# EAGLE design untitled (EAGLE 6.2)
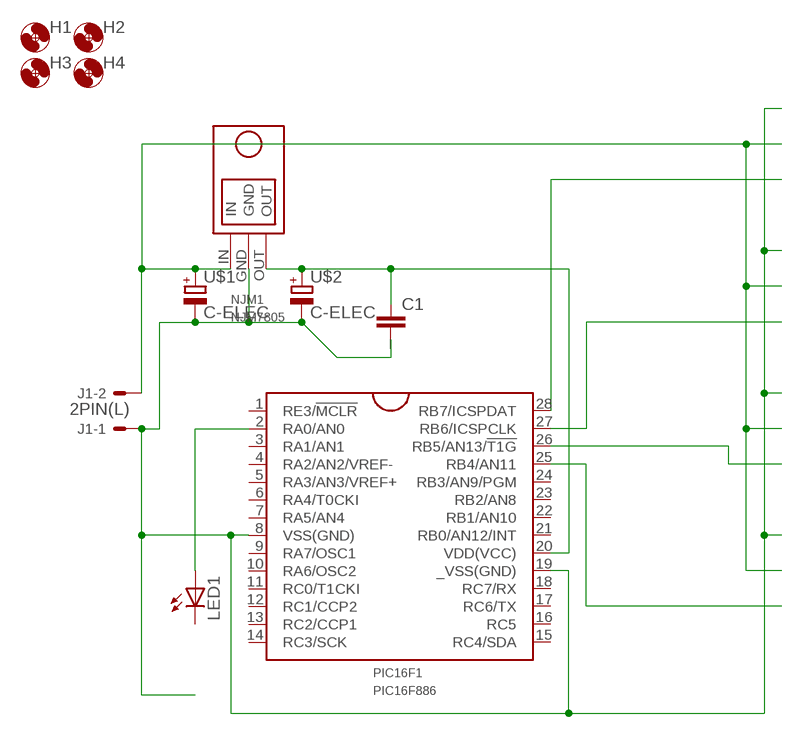
[diagram p0: schematic, sheet 1]

## Parts
C1  C-  [C-2.54]
H1  HOLE3.3M3BOLT  [HOLE3.3]
H2  HOLE3.3M3BOLT  [HOLE3.3]
H3  HOLE3.3M3BOLT  [HOLE3.3]
H4  HOLE3.3M3BOLT  [HOLE3.3]
J1  2PIN(L)  [2PL]
LED1  LED  [LED5MM]
NJM1  NJM7805  [NJM7805]
PIC16F1  PIC16F886  [DIL28-3]
U$1  C-ELEC  [C-6MM]
U$2  C-ELEC  [C-6MM]

## Nets
N$1: J1.1 NJM1.GND PIC16F1.8(VSS(GND)) PIC16F1.19(_VSS(GND)) U$1.- U$2.-
N$2: J1.2 NJM1.IN U$1.+
N$3: NJM1.OUT PIC16F1.20(VDD(VCC)) U$2.+
N$4: PIC16F1.28(RB7/ICSPDAT)
N$6: PIC16F1.27(RB6/ICSPCLK)
N$7: PIC16F1.26(RB5/AN13/!T1G)
N$8: PIC16F1.25(RB4/AN11)
N$9: LED1.A PIC16F1.2(RA0/AN0)
Unconnected: C1.P$1 C1.P$2 LED1.K(C) PIC16F1.1(RE3/!MCLR) PIC16F1.3(RA1/AN1) PIC16F1.4(RA2/AN2/VREF-) PIC16F1.5(RA3/AN3/VREF+) PIC16F1.6(RA4/T0CKI) PIC16F1.7(RA5/AN4) PIC16F1.9(RA7/OSC1) PIC16F1.10(RA6/OSC2) PIC16F1.11(RC0/T1CKI) PIC16F1.12(RC1/CCP2) PIC16F1.13(RC2/CCP1) PIC16F1.14(RC3/SCK) PIC16F1.15(RC4/SDA) PIC16F1.16(RC5) PIC16F1.17(RC6/TX) PIC16F1.18(RC7/RX) PIC16F1.21(RB0/AN12/INT) PIC16F1.22(RB1/AN10) PIC16F1.23(RB2/AN8) PIC16F1.24(RB3/AN9/PGM)

## Library data of the parts
C1 = My_rcl:C-
H1-H4 = FP-21T for MITS:HOLE3.3
J1 = my_connector:2PIN(L)
LED1 = led:LED: LED
NJM1 = My_NJM7805:NJM7805
PIC16F1 = FixLib:PIC16F886
U$1 U$2 = My_rcl:C-ELEC

## Board
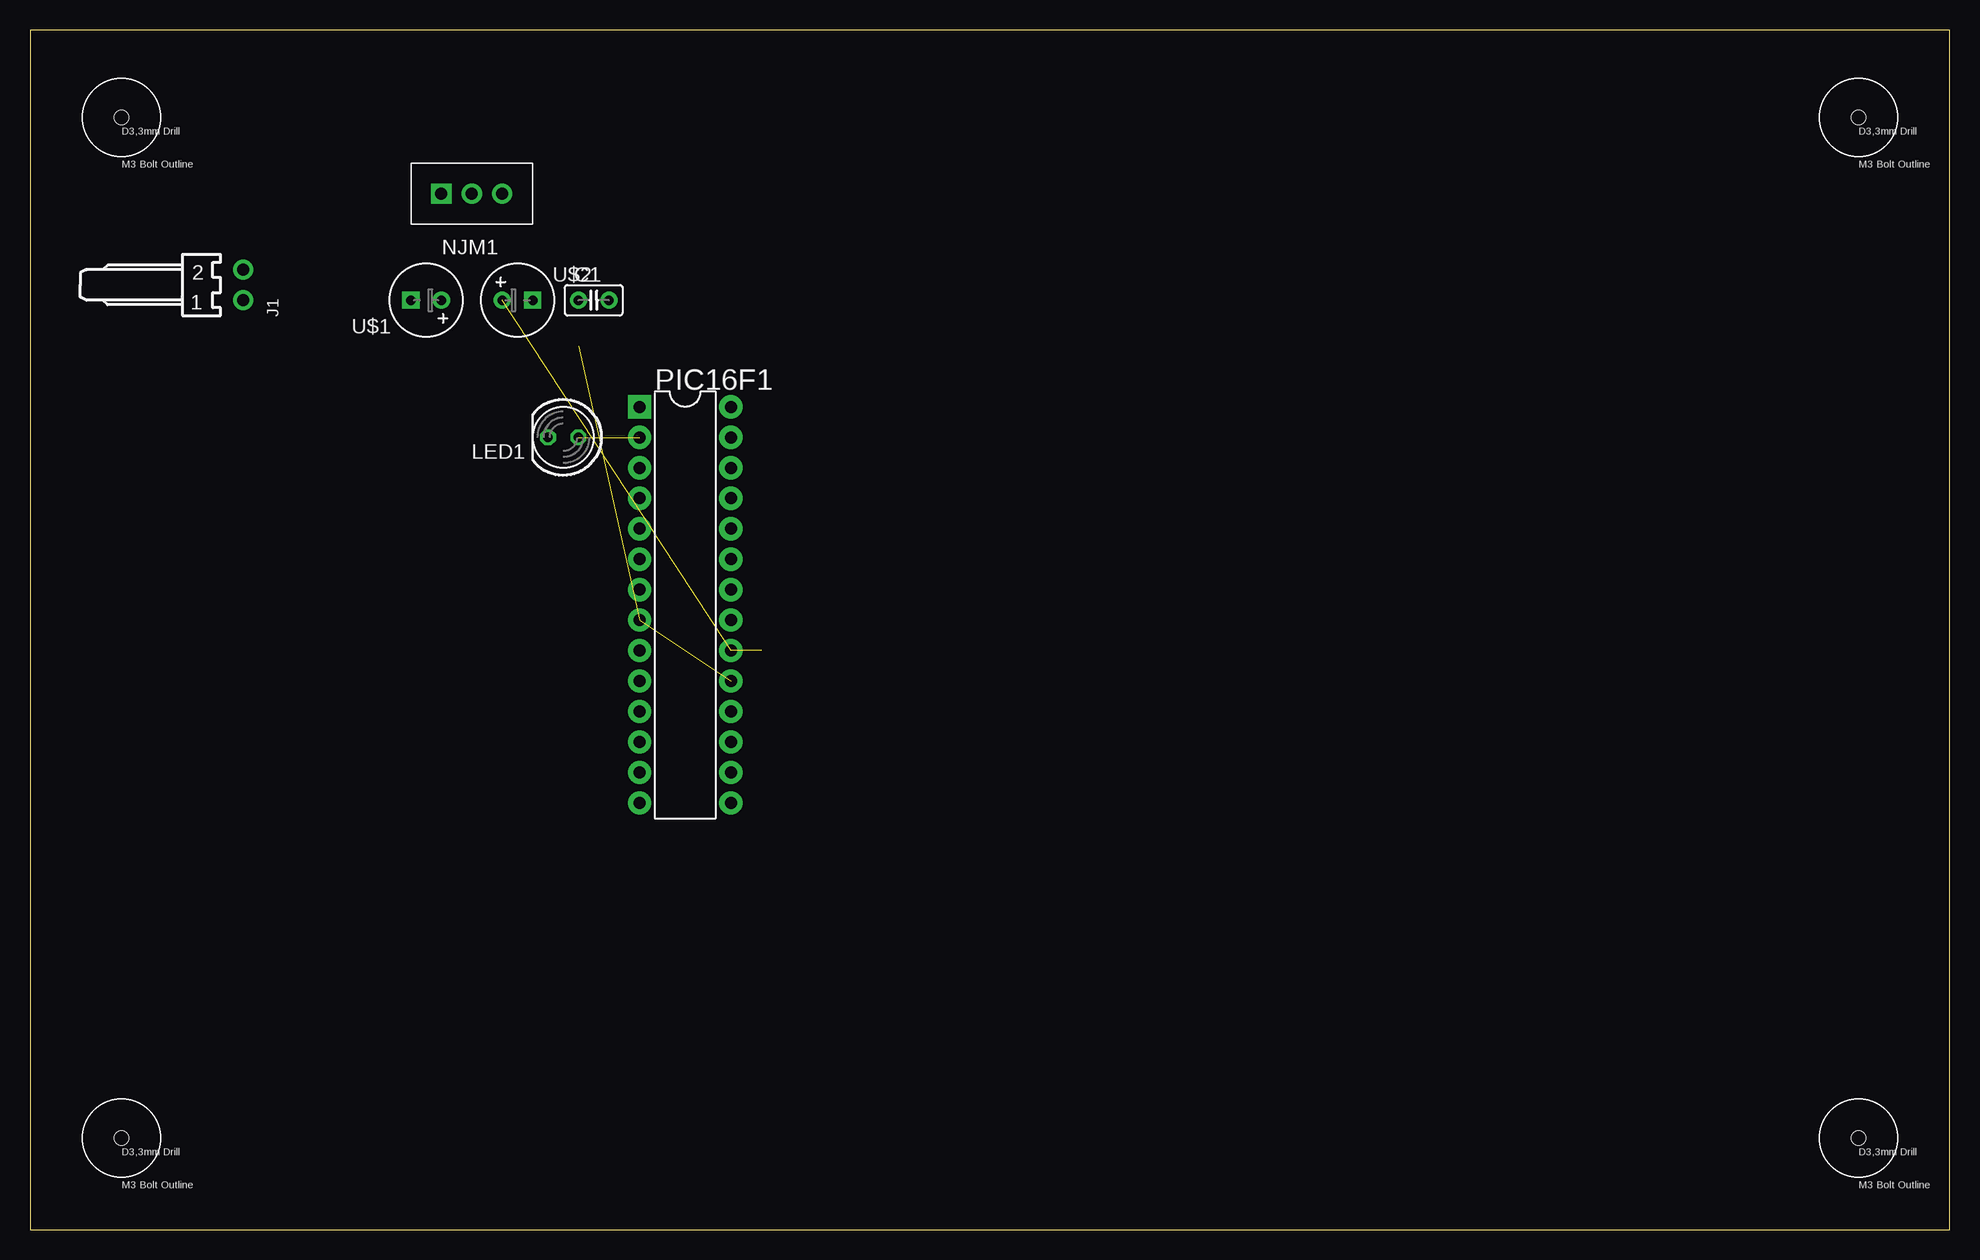
[diagram p1: board, top side]
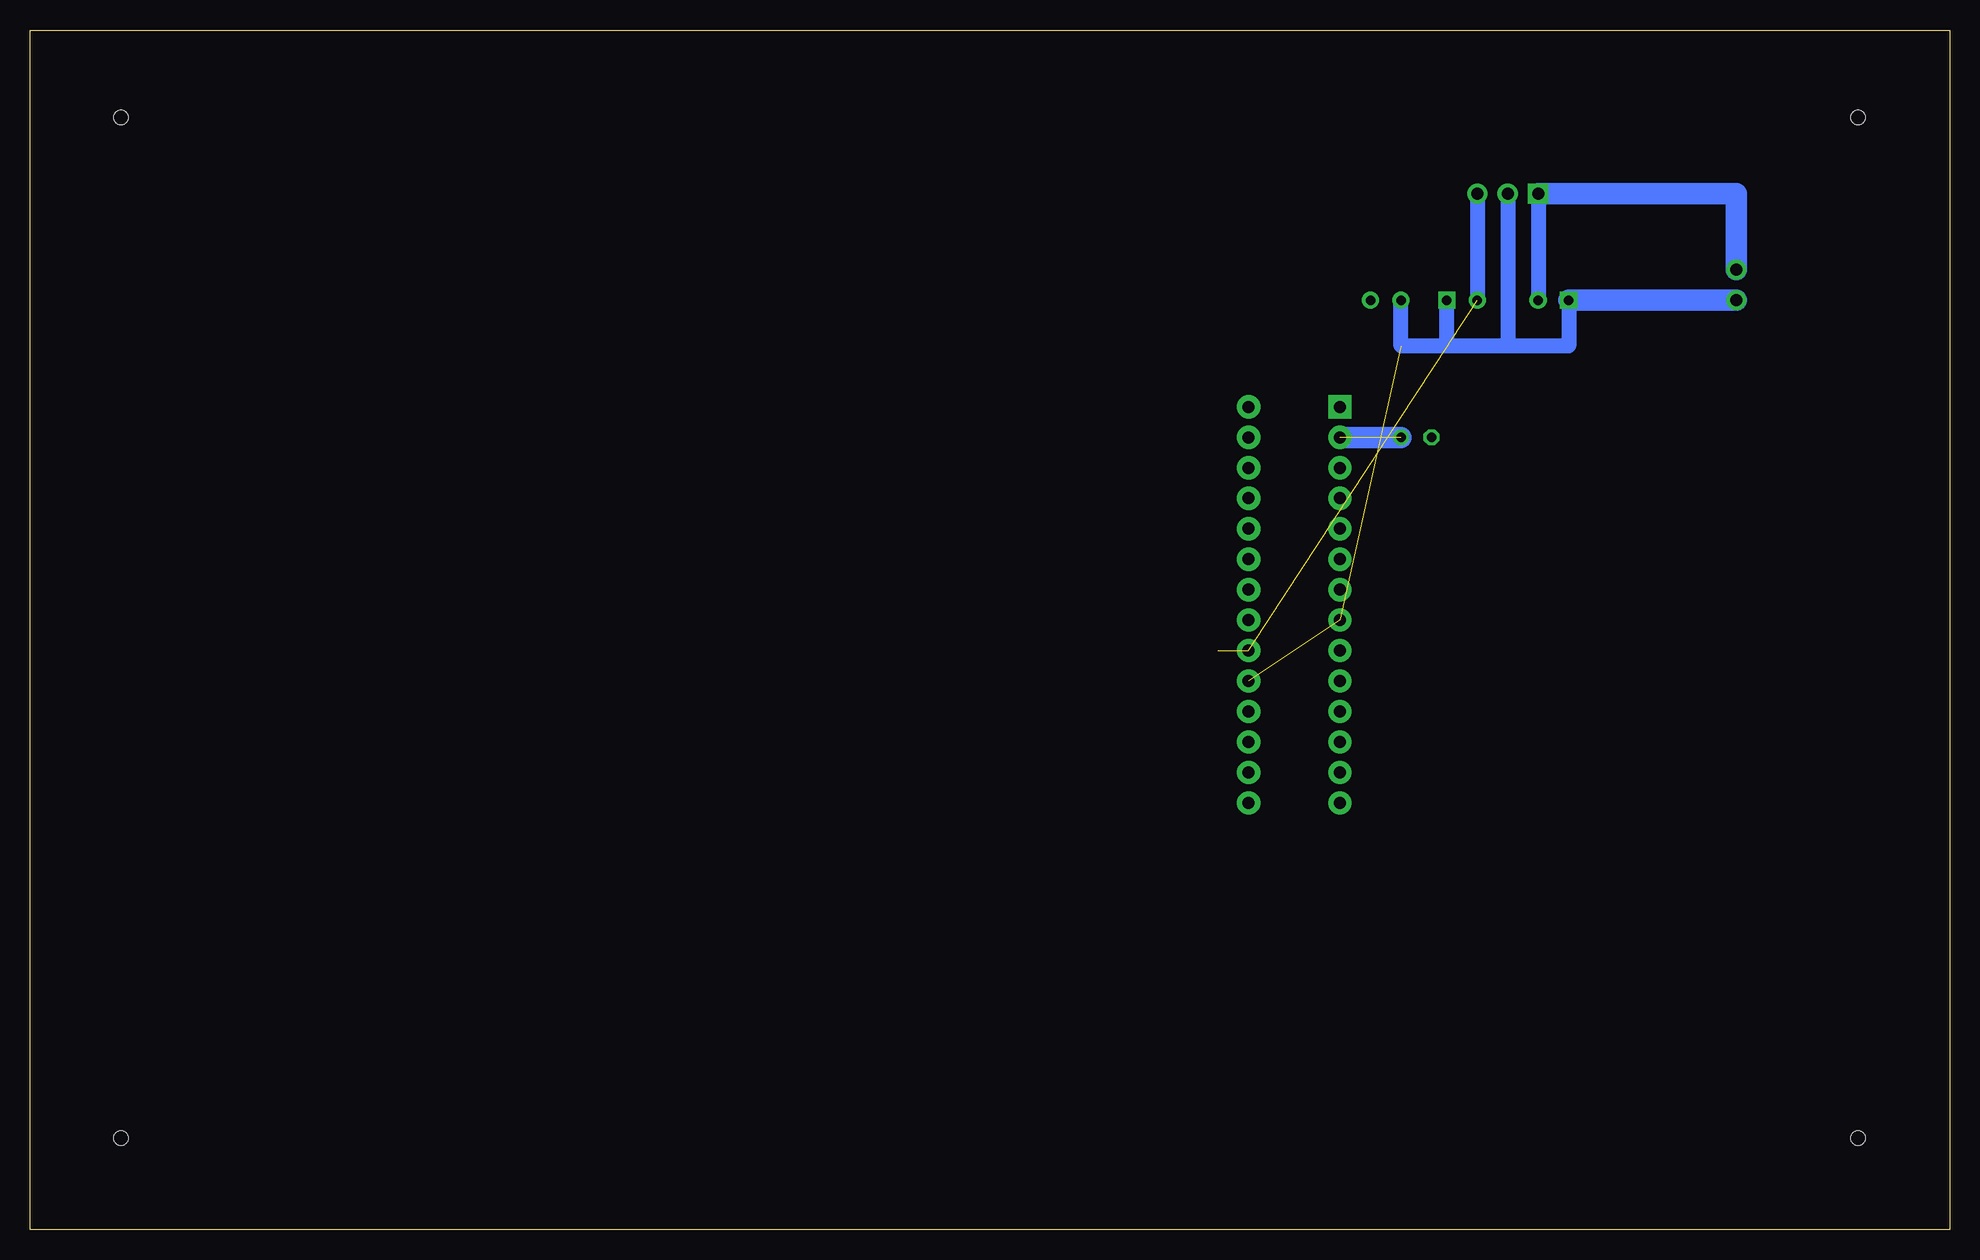
[diagram p2: board, bottom side, seen from below]

Size 160 x 100 mm. Coordinates in mm from the lower left corner, seen from the top.
Outline: 0,0 160,0 160,100 0,100 0,0
Copper layers (1*16): Top 0.035mm / dielectric 1.5mm / Bottom 0.035mm
Design rules: minimum track width 10mil, minimum drill 24mil, track to track 8mil, track to pad 8mil, pad to pad 8mil, via to via 8mil, smd to smd 8mil, copper to edge 40mil, drill to drill 8mil, minimum pad ring 10mil, minimum via ring 8mil, stop-mask expansion 4mil, vias tented up to drill 0mil, thermal gap 10mil

### Footprints (pad centres in the part's own frame; a part is rotated, then mirrored left to right if it is on the bottom)
C-2.54 = drill 0.8 pad 1.422: P$1 -1.27,0; P$2 1.27,0
HOLE3.3 = hole 1.2: 0,0
2PL = drill 1 pad 1.676: 1 1.27,3.81; 2 -1.27,3.81
LED5MM = drill 0.8 octagon: A -1.27,0; K 1.27,0
NJM7805 = drill 1 pad 1.676: GND 0,0; OUT 2.54,0 | drill 1 pad 1.676 square: IN -2.54,0
DIL28-3 = drill 1 pad 1.93 square: 1 -16.51,-3.81 | drill 1 pad 1.93: 2 -13.97,-3.81; 3 -11.43,-3.81; 4 -8.89,-3.81; 5 -6.35,-3.81; 6 -3.81,-3.81; 7 -1.27,-3.81; 8 1.27,-3.81; 9 3.81,-3.81; 10 6.35,-3.81; 11 8.89,-3.81; 12 11.43,-3.81; 13 13.97,-3.81; 14 16.51,-3.81; 15 16.51,3.81; 16 13.97,3.81; 17 11.43,3.81; 18 8.89,3.81; 19 6.35,3.81; 20 3.81,3.81; 21 1.27,3.81; 22 -1.27,3.81; 23 -3.81,3.81; 24 -6.35,3.81; 25 -8.89,3.81; 26 -11.43,3.81; 27 -13.97,3.81; 28 -16.51,3.81
C-6MM = drill 0.8 pad 1.422: + -1.27,0 | drill 0.8 pad 1.422 square: - 1.27,0

### Placement (x,y rotation side)
C1  46.99,77.47 0 top
H1  7.62,92.71 0 top
H2  7.62,7.62 0 top
H3  152.4,7.62 0 top
H4  152.4,92.71 0 top
J1  13.97,78.74 270 top
LED1  44.45,66.04 180 top
NJM1  36.83,86.36 0 top
PIC16F1  54.61,52.07 270 top
U$1  33.02,77.47 180 top
U$2  40.64,77.47 0 top

### Tracks (layer width: path | path; a pad name or v marks a point on that pad's centre or on a via)
N$1  (2 unrouted)
  Bottom 1.27: NJM1.GND 36.83,73.66 | 36.83,73.66 41.91,73.66 | 41.91,73.66 U$2.- | U$1.- 31.75,73.66 36.83,73.66 | 41.91,73.66 45.72,73.66 45.72,77.47
  Bottom 1.778: J1.1 U$1.-
N$2
  Bottom 1.27: NJM1.IN U$1.+
  Bottom 1.778: NJM1.IN 17.78,86.36 J1.2
N$3  (2 unrouted)
  Bottom 1.27: NJM1.OUT U$2.+
N$9  (1 unrouted)
  Bottom 1.778: PIC16F1.2 LED1.A